# EAGLE design I2C-7-Segment-Backpack-dot8inch (EAGLE 9.5.2)
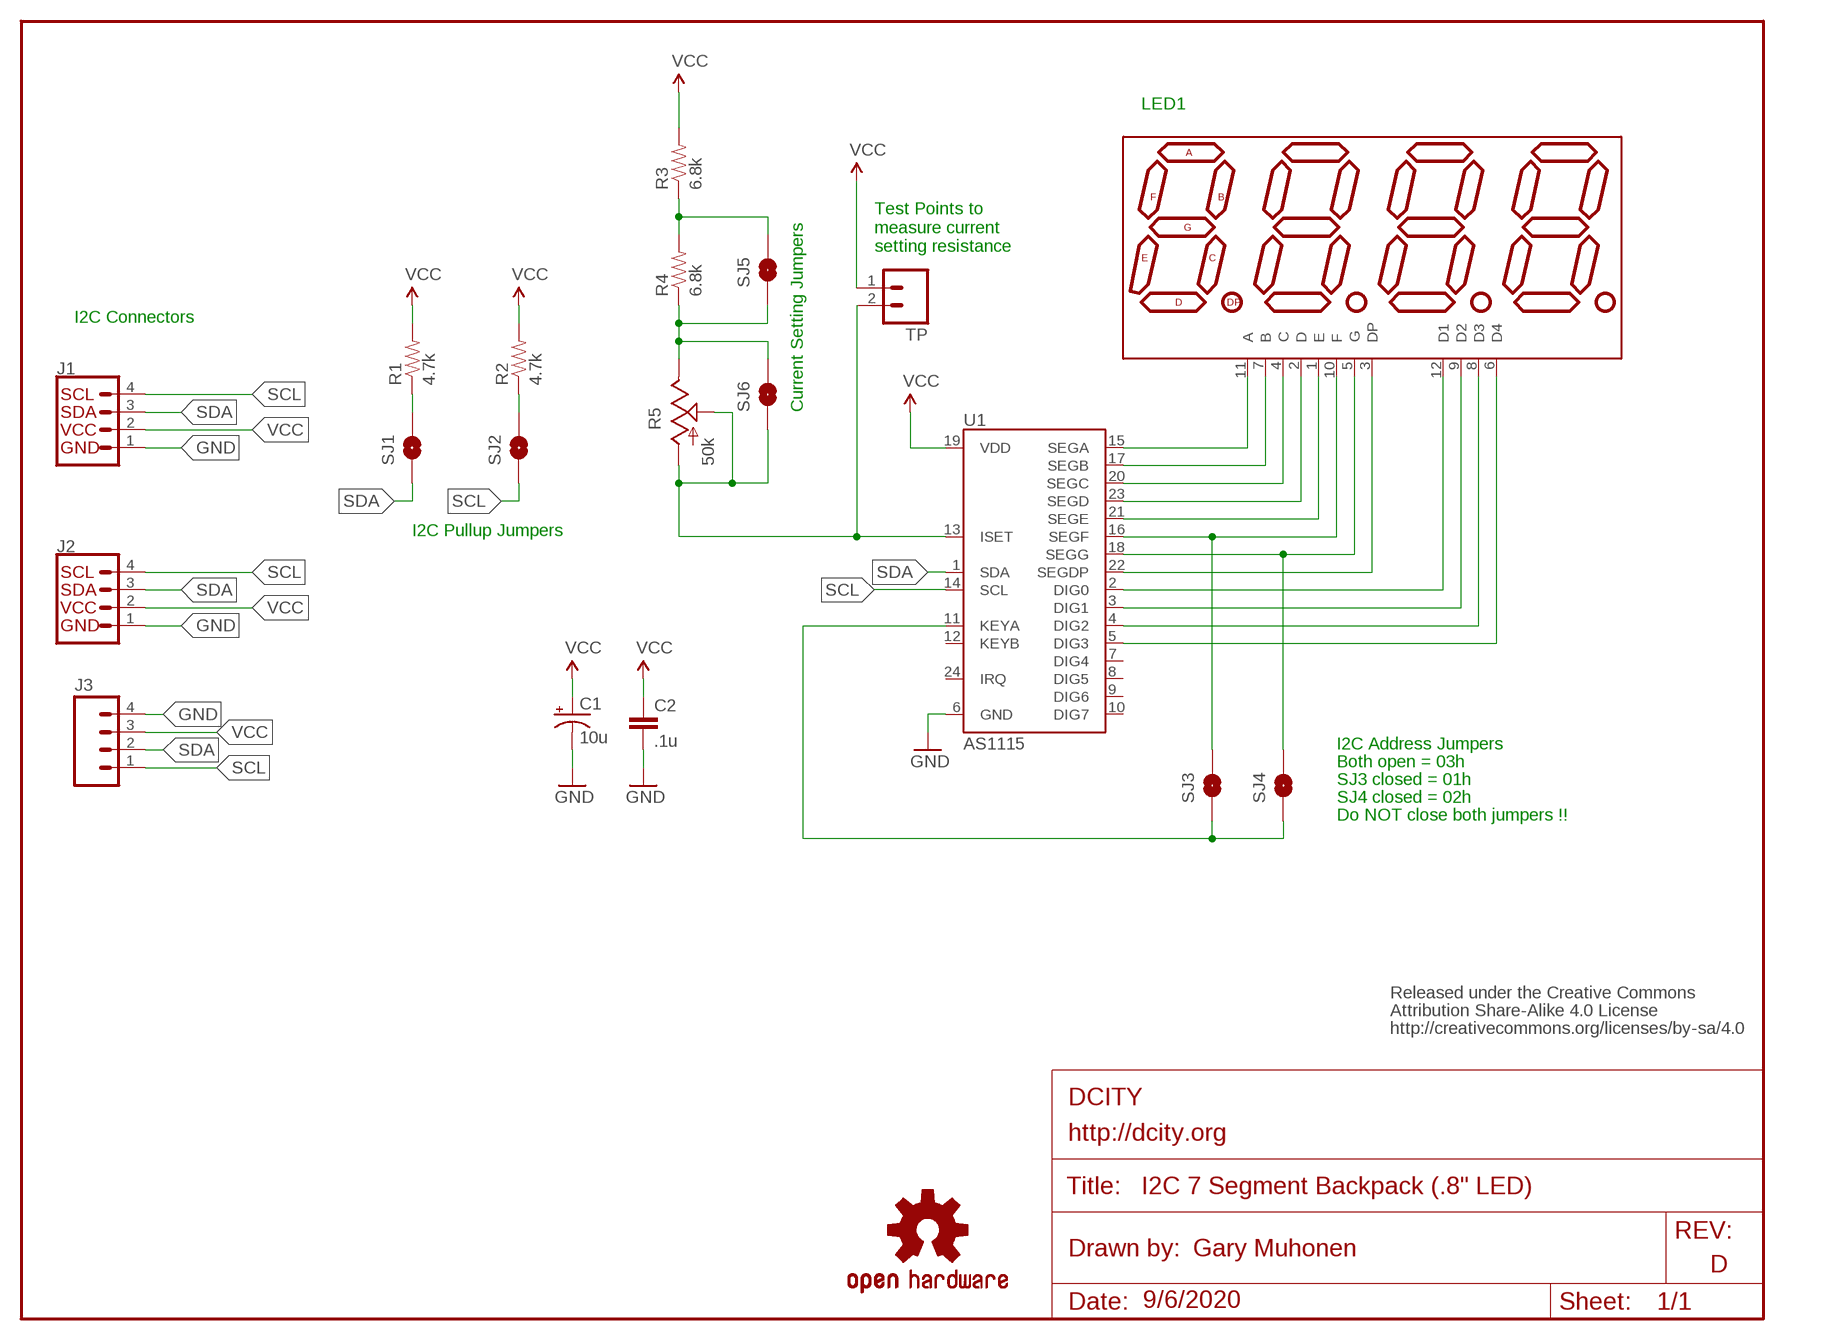
[diagram p0: schematic, sheet 1]
U$1 (DOCFIELD-WHT): COMPANYNAME: DCITY; COMPANYWEBSITE: http://dcity.org; DATE: 9/6/2020; DRAWNBY: Gary Muhonen; TITLE: I2C 7 Segment Backpack (.8" LED); VERSION: D

## Parts
C1  10u  CAP_POL0805  [0805-POL]
C2  .1u  CAP0805  [0805-CAP]
DISP1  LED1  7-SEGMENT-4DIGIT-COUNTER  [7-SEGMENT-4DIGIT-COUNTER-NO-SILK]
J1  QWIIC_RIGHT_ANGLE  QWIIC_CONNECTORJS-1MM  [JST04_1MM_RA]
J2  QWIIC_RIGHT_ANGLE  QWIIC_CONNECTORJS-1MM  [JST04_1MM_RA]
J3  M04LOCK  [1X04_LOCK]
LOGO1  OSHW-LOGOS  [OSHW-LOGO-S]
R1  4.7k  RESISTOR0805  [0805-RES]
R2  4.7k  RESISTOR0805  [0805-RES]
R3  6.8k  RESISTOR0805  [0805-RES]
R4  6.8k  RESISTOR0805  [0805-RES]
R5  50k  POT-TC33X  [POT-TC33X]
SJ1  SOLDERJUMPERNO  [SJ_2S-NO]
SJ2  SOLDERJUMPERNO  [SJ_2S-NO]
SJ3  SOLDERJUMPERNO  [SJ_2S-NO]
SJ4  SOLDERJUMPERNO  [SJ_2S-NO]
SJ5  SOLDERJUMPERNO  [SJ_2S-NO]
SJ6  SOLDERJUMPERNO  [SJ_2S-NO]
TP  M02PTH  [1X02]
U1  AS1115  AS1115-LP  [TSSOP-24]
U$2  CREATIVE_COMMONS  [CREATIVE_COMMONS]

## Nets
GND: C1.- C2.2 J1.1 J2.1 J3.4 U1.6(GND)
N$1: DISP1.11(A) U1.15(SEGA)
N$2: DISP1.7(B) U1.17(SEGB)
N$3: DISP1.4(C) U1.20(SEGC)
N$4: DISP1.2(D) U1.23(SEGD)
N$5: DISP1.1(E) U1.21(SEGE)
N$6: DISP1.10(F) SJ3.2 U1.16(SEGF)
N$7: DISP1.5(G) SJ4.2 U1.18(SEGG)
N$8: DISP1.3(DP) U1.22(SEGDP)
N$9: DISP1.12(D1) U1.2(DIG0)
N$10: DISP1.9(D2) U1.3(DIG1)
N$11: DISP1.8(D3) U1.4(DIG2)
N$12: DISP1.6(D4) U1.5(DIG3)
N$13: SJ3.1 SJ4.1 U1.11(KEYA)
N$14: R5.1(A) R5.2(S) SJ6.1 TP.2 U1.13(ISET)
N$15: R4.1 R5.3(E) SJ5.1 SJ6.2
N$16: R3.1 R4.2 SJ5.2
N$20: R1.1 SJ1.2
N$21: R2.1 SJ2.2
SCL: J1.4 J2.4 J3.1 SJ2.1 U1.14(SCL)
SDA: J1.3 J2.3 J3.2 SJ1.1 U1.1(SDA)
VCC: C1.+ C2.1 J1.2 J2.2 J3.3 R1.2 R2.2 R3.2 TP.1 U1.19(VDD)
Unconnected: U1.7(DIG4) U1.8(DIG5) U1.9(DIG6) U1.10(DIG7) U1.12(KEYB) U1.24(IRQ)

## Notes on the sheet
- LED1
- Test Points to
  measure current
  setting resistance
- I2C Connectors
- Current Setting Jumpers
- I2C Pullup Jumpers
- I2C Address Jumpers
- Both open = 03h
- SJ3 closed = 01h
- SJ4 closed = 02h
- Do NOT close both jumpers !!

## Library data of the parts
C1 = 0:CAP_POL: Capacitor Polarized These are standard SMD and PTH capacitors. Normally 10uF, 47uF, and 100uF in electrolytic and tantalum varieties. Always verify the external diameter of the through hole cap, it varies with capacity, voltage, and manufacturer. The EIA devices should be standard.
C2 = 0:CAP: Capacitor Standard 0603 ceramic capacitor, and 0.1" leaded capacitor.
DISP1 = 0:7-SEGMENT-4DIGIT-COUNTER
J1 J2 = 0:QWIIC_CONNECTOR: SparkFun I2C Standard Qwiic Connector An SMD 1mm pitch JST connector makes it easy and quick (get it? Qwiic?) to connect I2C devices to each other. The Qwiic system <http://www.sparkfun.com/qwiic> enables fast and solderless connection between popular platforms and various sensors and actuators. We carry 200mm <https://www.sparkfun.com/products/14204>, 100mm <https://www.sparkfun.com/products/14205>, 50mm <https://www.sparkfun.com/products/14206>, and breadboard friendly <https://www.sparkfun.com/products/14207> Qwiic cables. We also offer 10 pcs strips <https://www.sparkfun.com/products/14323> the SMD connectors.; PROD_ID: CONN-13694
J3 = 0:M04: Header 4 Standard 4-pin 0.1" header. Use with straight break away headers (SKU : PRT-00116), right angle break away headers (PRT-00553), swiss pins (PRT-00743), machine pins (PRT-00117), and female headers (PRT-00115). Molex polarized connector foot print use with SKU : PRT-08231 with associated crimp pins and housings.
LOGO1 = 0:OSHW-LOGO: Open Source Hardware Logo This logo indicates the piece of hardware it is found on incorporates a OSHW license and/or adheres to the definition of open source hardware found here: http://freedomdefined.org/OSHW
R1-R4 = 0:RESISTOR: Resistor Basic schematic elements and footprints for 0603, 1206, and PTH 1/10th watt (small) resistors.
R5 = 0:POT
SJ1-SJ6 = 0:SOLDERJUMPER: Solder Jumper Standard SMD solder jumper. Used to automate production. Two varients : Normally Open and Normally Closed are the same, but have different paste layers. NC will have a large amount of paste and should jumper during reflow.
TP = 0:M02: Header 2 Standard 2-pin 0.1" header. Use with straight break away headers (SKU : PRT-00116), right angle break away headers (PRT-00553), swiss pins (PRT-00743), machine pins (PRT-00117), and female headers (PRT-00115). Molex polarized connector foot print use with SKU : PRT-08233 with associated crimp pins and housings.
U1 = 0:AS1115: 8 Digit 7 segment LED Driver Packages: TSSOP-24, 24-pin QFN
U$2 = 0:CREATIVE_COMMONS

## Board
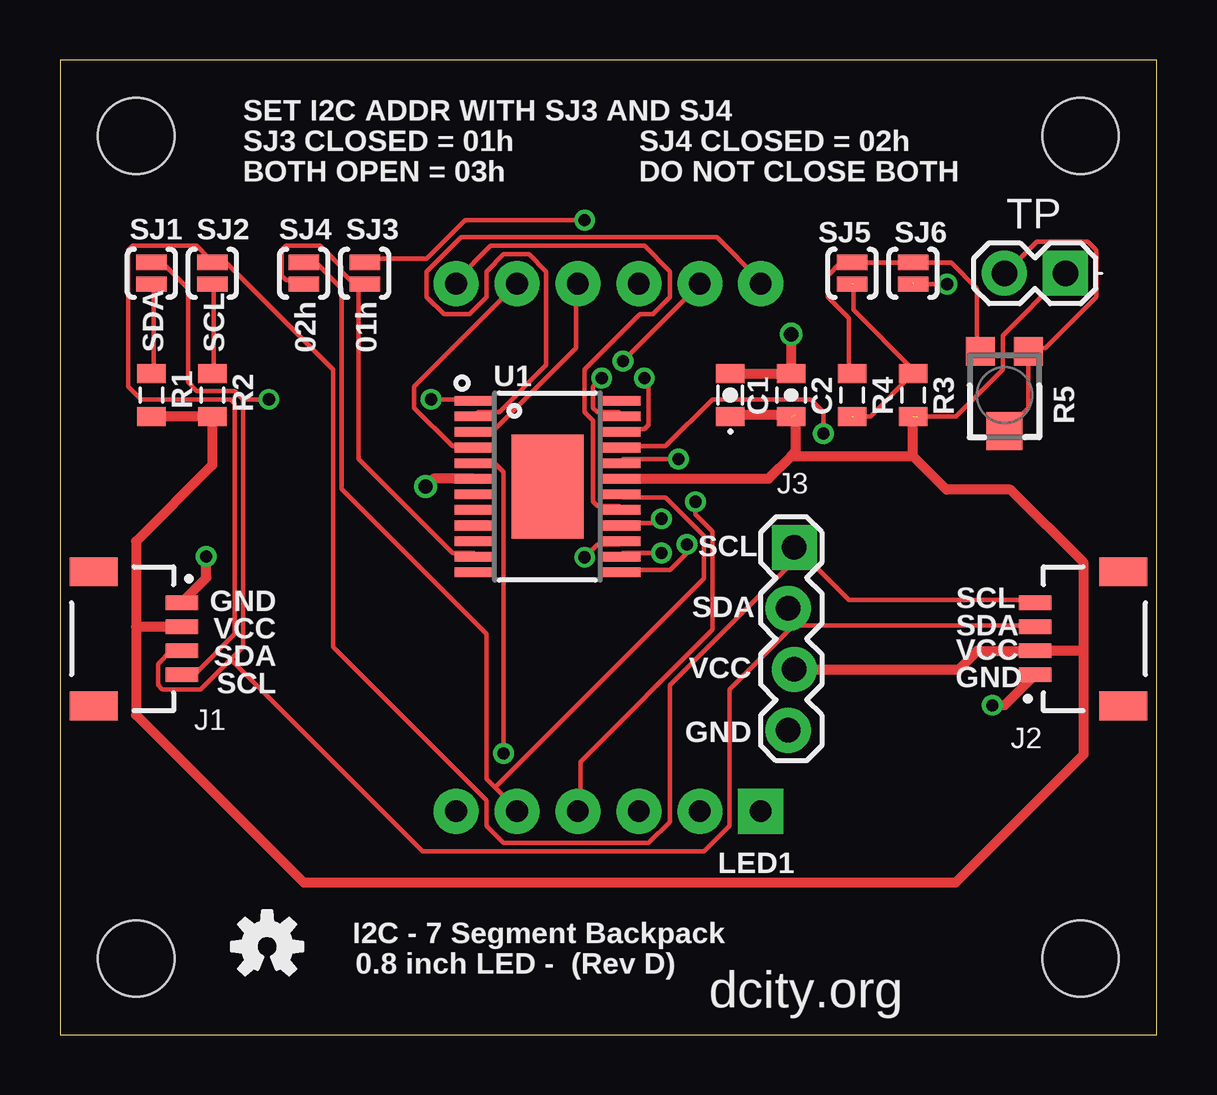
[diagram p1: board, top side]
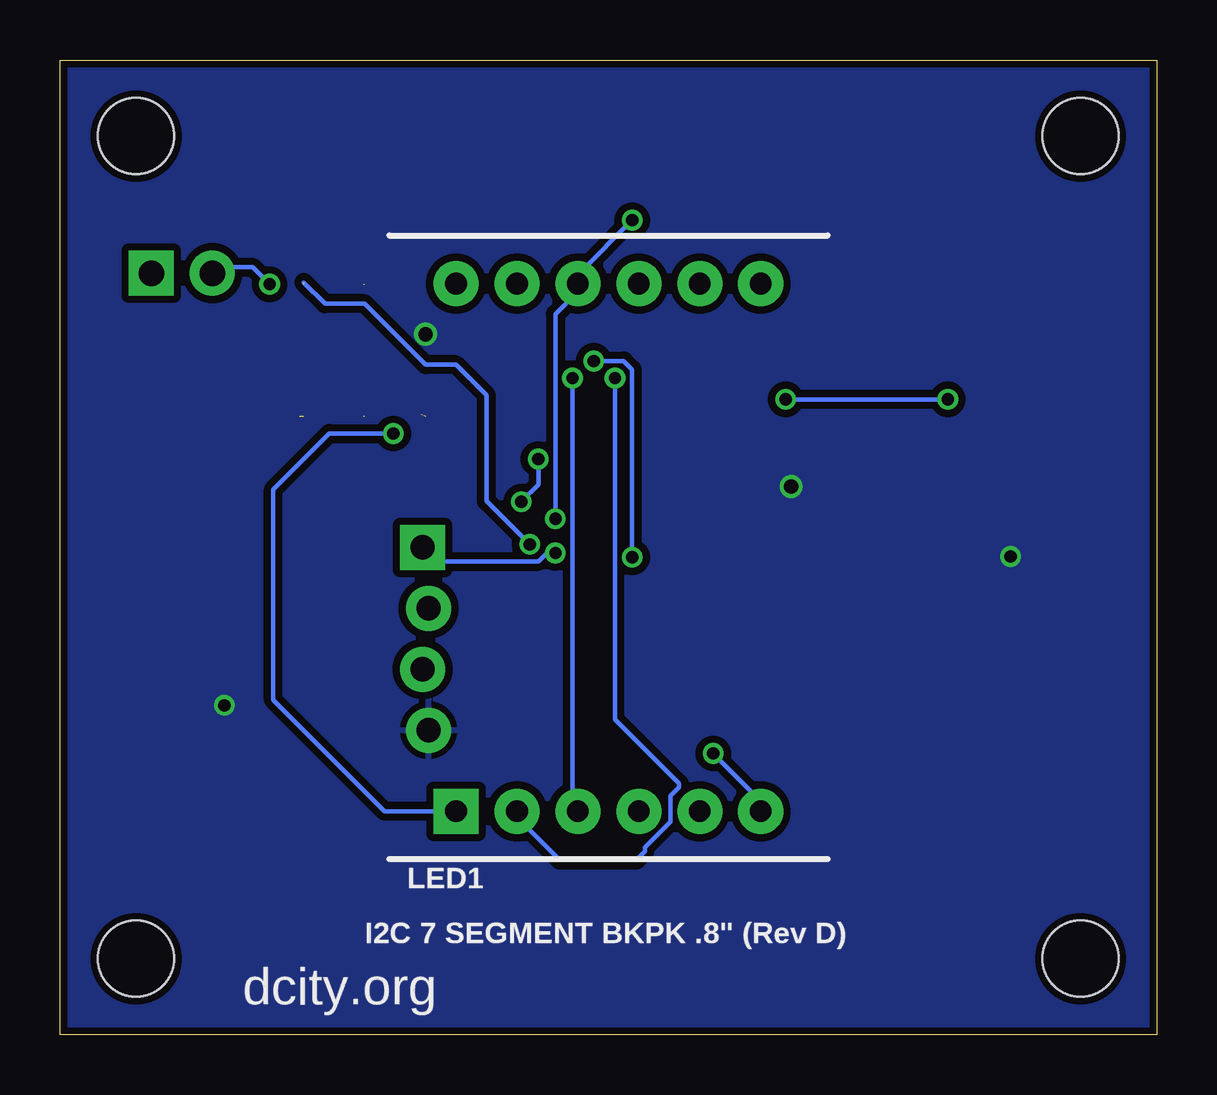
[diagram p2: board, bottom side, seen from below]

Size 45.72 x 40.64 mm. Coordinates in mm from the lower left corner, seen from the top.
Outline: 0,0 45.72,0 45.72,40.64 0,40.64 0,0
Copper layers (1*16): Top 0.035mm / dielectric 1.5mm / Bottom 0.035mm
Design rules "7mils-gary": minimum track width 7mil, minimum drill 20mil, track to track 7mil, track to pad 7mil, pad to pad 7mil, via to via 7mil, smd to smd 7mil, copper to edge 7mil, drill to drill 7mil, minimum pad ring 7mil, minimum via ring 7mil, stop-mask expansion 4mil, vias tented up to drill 25mil, thermal gap 10mil
Holes 3.17 mm at 3.17,37.47 42.55,37.47 42.55,3.17 3.17,3.17
vRestrict: area 2.5,33 to 5,34.3; area 5.3,33 to 7.7,34.2; area 8.8,33 to 11.2,34.3; area 11.6,33 to 14.1,34.2; area 31.4,33 to 33.8,34; area 34.5,32.9 to 36.8,34; area 28.6,25.8 to 29.6,27.3; area 31.2,25.7 to 32.4,27.4; area 33.8,25.7 to 34.8,27.3; area 36.3,25.7 to 37.3,27.4; area 41.3,25.3 to 42.4,27.1; area 39.5,11.8 to 41.1,13; 19 more areas

### Footprints (pad centres in the part's own frame; a part is rotated, then mirrored left to right if it is on the bottom)
0805-POL = smd 0.8 x 1.2: + 0.9,0; - -0.9,0
0805-CAP = smd 0.8 x 1.2: 1 -0.9,0; 2 0.9,0
7-SEGMENT-4DIGIT-COUNTER-NO-SILK = drill 0.9 pad 1.88 square: 1 -6.35,-10.998 | drill 0.9 pad 1.88: 2 -3.81,-10.998; 3 -1.27,-10.998; 4 1.27,-10.998; 5 3.81,-10.998; 6 6.35,-10.998; 7 6.35,10.998; 8 3.81,10.998; 9 1.27,10.998; 10 -1.27,10.998; 11 -3.81,10.998; 12 -6.35,10.998
JST04_1MM_RA = smd 0.6 x 1.35: 1 -1.5,0; 2 -0.5,0; 3 0.5,0; 4 1.5,0 | smd 1.2 x 2: NC1 2.8,-3.675; NC2 -2.8,-3.675
1X04_LOCK = drill 1.016 pad 1.88 square: 1 0,0.127 | drill 1.016 pad 1.88: 2 2.54,-0.127; 3 5.08,0.127; 4 7.62,-0.127
0805-RES = smd 0.8 x 1.2: 1 -0.9,0; 2 0.9,0
POT-TC33X = smd 1.2 x 1.2: 1 -1,-1.825; 3 1,-1.825 | smd 1.5 x 1.6: 2 0,1.5
SJ_2S-NO = smd 0.635 x 1.27: 1 -0.45,0; 2 0.45,0
1X02 = drill 1.067 pad 1.88 square: 1 0,0 | drill 1.067 pad 1.88: 2 2.54,0
TSSOP-24 = smd 0.4 x 1.65: 1 -3.575,-3.05; 2 -2.925,-3.05; 3 -2.275,-3.05; 4 -1.625,-3.05; 5 -0.975,-3.05; 6 -0.325,-3.05; 7 0.325,-3.05; 8 0.975,-3.05; 9 1.625,-3.05; 10 2.275,-3.05; 11 2.925,-3.05; 12 3.575,-3.05; 13 3.575,3.05; 14 2.925,3.05; 15 2.275,3.05; 16 1.625,3.05; 17 0.975,3.05; 18 0.325,3.05; 19 -0.325,3.05; 20 -0.975,3.05; 21 -1.625,3.05; 22 -2.275,3.05; 23 -2.925,3.05; 24 -3.575,3.05 | smd 4.32 x 3: EP 0,0

### Placement (x,y rotation side)
C1  27.94,26.67 270 top
C2  30.48,26.67 90 top
DISP1  22.86,20.32 0 bottom
J1  5.08,16.51 270 top
J2  40.64,16.51 90 top
J3  30.48,20.32 270 top
LOGO1  8.64,3.68 0 top
R1  3.81,26.67 270 top
R2  6.35,26.67 270 top
R3  35.56,26.67 270 top
R4  33.02,26.67 270 top
R5  39.37,26.67 180 top
SJ1  3.81,31.75 270 top
SJ2  6.35,31.75 270 top
SJ3  12.7,31.75 90 top
SJ4  10.16,31.75 90 top
SJ5  33.02,31.75 270 top
SJ6  35.56,31.75 90 top
TP  41.91,31.75 180 top
U1  20.32,22.86 270 top
U$2  1.27,41.91 0 top

### Tracks (layer width: path | path; a pad name or v marks a point on that pad's centre or on a via)
GND  (via drill 0.51, 0.6)
  Top 0.406: C1.- C2.2 v30.48,29.21 | U1.6 15.56,23.18 v15.24,22.86 | 38.76,13.74 v38.86,13.74 39.37,13.74 J2.1 | J1.1 5.08,18.03 6.1,19.05 v6.1,19.94
  pour Bottom (isolate 0.305): 0,40.64 45.72,40.64 45.72,0 0,0
N$1  (via drill 0.51)
  Top 0.178: v21.87,19.91 22.4,20.45 23.29,20.45 U1.15 | v23.47,28.09 26.67,31.29 DISP1.11
  Bottom 0.178: v21.87,19.91 21.87,27.74 22.23,28.09 v23.47,28.09
N$2
  Top 0.178: U1.17 23.29,22.05 22.4,22.05 22.23,22.23 22.23,25.6 21.87,25.96 21.87,27.74 24.18,30.05 24.71,30.05 25.43,30.76 25.43,31.83 24.36,32.89 17.96,32.89 16.54,31.47 DISP1.7
N$3  (via drill 0.51)
  Top 0.178: v25.78,24 23.47,24 U1.20 | v26.49,22.23 26.49,21.69 27.2,20.98 27.2,16.89 21.69,11.38 21.69,9.42 DISP1.4
  Bottom 0.178: v25.78,24 25.78,22.94 v26.49,22.23
N$4  (via drill 0.51)
  Top 0.178: v22.58,27.38 22.23,27.03 22.23,26.14 22.4,25.96 23.29,25.96 U1.23
  Bottom 0.178: v22.58,27.38 22.58,13.16 19.91,10.49 19.91,10.31 20.27,9.96 20.27,8.89 21.34,7.82 21.34,7.64 21.69,7.29 24.89,7.29 26.67,9.07 DISP1.2
N$5  (via drill 0.51)
  Top 0.178: v31.83,25.07 31.83,25.96 31.29,26.49 27.2,26.49 25.25,24.54 23.47,24.54 U1.21
  Bottom 0.178: v31.83,25.07 34.49,25.07 36.83,22.73 36.83,13.97 32.18,9.32 DISP1.1
N$6  (via drill 0.51)
  Top 0.178: v21.87,33.96 16.89,33.96 15.29,32.36 12.8,32.36 SJ3.2 | v25.07,21.51 24.89,21.34 23.47,21.34 U1.16
  Bottom 0.178: v21.87,33.96 24,31.83 24,31.47 DISP1.10 24.18,31.29 24.18,30.94 25.07,30.05 v25.07,21.51
N$7
  Top 0.178: 18.14,10.31 19.02,9.42 DISP1.5 | 18.14,10.31 17.78,10.67 17.78,16.71 11.73,22.76 11.73,31.11 10.67,32.18 10.31,32.18 SJ4.2 | 18.14,10.31 26.85,19.02 26.85,20.8 25.25,22.4 23.47,22.4 U1.18
N$8  (via drill 0.51)
  Top 0.178: v24.36,27.38 24.54,27.2 24.54,25.43 24.36,25.25 23.47,25.25 U1.22
  Bottom 0.178: v24.36,27.38 24.36,9.6 24.18,9.42 DISP1.3
N$9
  Top 0.178: U1.2 17.42,25.96 18.31,25.96 20.27,27.91 20.27,31.83 19.56,32.54 18.49,32.54 17.78,31.83 17.78,30.76 17.07,30.05 16,30.05 15.29,30.76 15.29,31.83 16.71,33.25 27.38,33.25 29.16,31.47 DISP1.12
N$10
  Top 0.178: U1.3 17.42,25.25 18.14,25.25 21.51,28.63 21.51,31.29 DISP1.9
N$11
  Top 0.178: DISP1.8 14.76,27.03 14.76,26.14 16.36,24.54 17.25,24.54 U1.4
N$12  (via drill 0.51)
  Top 0.178: v18.49,11.73 18.49,23.47 18.14,23.82 17.42,23.82 U1.5
  Bottom 0.178: v18.49,11.73 16.54,9.78 16.54,9.42 DISP1.6
N$13
  Top 0.178: 12.45,31.47 12.62,31.47 SJ3.1 12.45,31.47 | 12.45,31.47 12.09,31.47 11.73,31.83 11.73,32 10.85,32.89 9.42,32.89 9.25,32.72 9.25,31.65 9.42,31.47 10.13,31.47 SJ4.1 | 12.45,31.47 12.45,24 16.36,20.09 17.25,20.09 U1.11
N$14  (via drill 0.51)  (1 unrouted)
  Top 0.178: R5.2 39.47,25.25 40.36,26.14 40.36,28.45 R5.1 40.54,28.63 41.07,28.63 43.2,30.76 43.2,32.72 42.85,33.07 40.72,33.07 39.47,31.83 39.45,31.83 TP.2 | v36.98,31.29 SJ6.1 | v26.14,20.45 26.14,20.09 25.43,19.38 23.47,19.38 U1.13
  Bottom 0.178: v36.98,31.29 37.69,32 39.12,32 TP.2 | v26.14,20.45 27.94,22.25 27.94,26.67 29.21,27.94 30.48,27.94 33.02,30.48 34.67,30.48 35.56,31.37
N$15
  Top 0.178: R4.1 32.89,27.74 32.89,29.87 32,30.76 32,31.65 32.54,32.18 32.89,32.18 SJ5.1 33.07,32.18 35.56,32.18 | 35.56,32.18 37.16,32.18 38.23,31.11 38.23,28.63 R5.3 | 35.56,32.18 SJ6.2
N$16  (2 unrouted)
  Top 0.178: 33.07,25.78 33.78,25.78 R3.1 35.56,27.74 33.07,30.23 33.07,31.29
N$20
  Top 0.178: R1.1 3.91,27.74 3.91,31.29 SJ1.2
N$21
  Top 0.178: R2.1 6.4,27.74 6.4,31.29 SJ2.2
SCL  (via drill 0.51)
  Top 0.178: v25.07,20.09 23.47,20.09 U1.14 | 30.94,20.09 30.76,20.27 J3.1 30.94,20.09 | 6.93,32.18 6.4,32.18 SJ2.1 | 30.94,20.09 25.43,14.58 25.43,8.89 24.54,8 18.49,8 17.78,8.71 17.78,9.78 11.38,16.18 11.38,27.74 6.93,32.18 | 6.93,32.18 SJ2.1 | J1.4 5.16,15.11 5.69,15.11 7.29,16.71 7.29,26.31 7.11,26.49 3.38,26.49 2.85,27.03 2.85,32.72 3.02,32.89 5.69,32.89 6.22,32.36 SJ2.1 | 30.94,20.09 32.89,18.14 40.54,18.14 J2.4
  Bottom 0.178: v25.07,20.09 25.43,20.09 25.78,19.74 30.05,19.74 30.58,20.27 J3.1
SDA  (via drill 0.51)
  Top 0.178: 30.58,17.6 30.4,17.78 J3.2 | 4.27,32.18 3.91,32.18 SJ1.1 4.27,32.18 | 17.25,26.31 U1.1 17.25,26.49 v15.47,26.49 | 30.58,17.07 30.58,17.6 | 30.58,17.07 27.91,14.4 27.91,8.71 26.85,7.64 15.11,7.64 7.11,15.65 | 30.58,17.6 J3.2 | 30.58,17.07 40.54,17.07 J2.3 | 30.58,17.07 J3.2 | 4.27,32.18 5.33,31.11 5.33,27.2 5.69,26.85 7.29,26.85 7.64,26.49 | 7.64,26.49 7.64,16.18 7.11,15.65 | 7.11,15.65 5.87,14.4 4.27,14.4 4.09,14.58 4.09,15.47 4.62,16 4.98,16 J1.3 | 7.64,26.49 v8.71,26.49
  Bottom 0.178: v8.71,26.49 v15.47,26.49
VCC  (2 unrouted)
  Top 0.178: 35.74,25.78 37.34,25.78 39.29,27.74 39.29,29.16 41.78,31.65 41.81,31.65 TP.1 | 40.72,16 J2.2
  Top 0.203: 28.09,25.86 C1.+
  Top 0.406: R1.2 R2.2 6.35,23.75 3.17,20.57 3.17,17.02 | 35.56,24.13 R3.2 | U1.19 29.54,23.18 30.48,24.13 | 30.66,25.86 30.66,24.31 30.48,24.13 | 30.48,24.13 35.56,24.13 | 28.09,25.86 30.39,25.86 C2.1 | 3.17,17.02 3.17,13.34 10.16,6.35 37.34,6.35 42.67,11.68 42.67,16 | 42.67,16 42.67,19.68 39.62,22.73 36.96,22.73 35.56,24.13 | J2.2 38.23,16.01 37.47,15.24 J3.3 | J1.2 3.18,17.01 3.17,17.02 | 42.67,16 40.72,16

### Text on the board
tPlace: SET I2C ADDR WITH SJ3 AND SJ4 | SJ3 CLOSED = 01h | SJ4 CLOSED = 02h | BOTH OPEN = 03h | DO NOT CLOSE BOTH | SDA | SCL | 02h | 01h | SCL | GND | SDA | SCL | VCC | SDA | SDA | VCC | VCC | SCL | GND | GND | LED1 | I2C - 7 Segment Backpack | 0.8 inch LED - (Rev D) | dcity.org
bPlace: LED1 | I2C 7 SEGMENT BKPK .8" (Rev D) | dcity.org